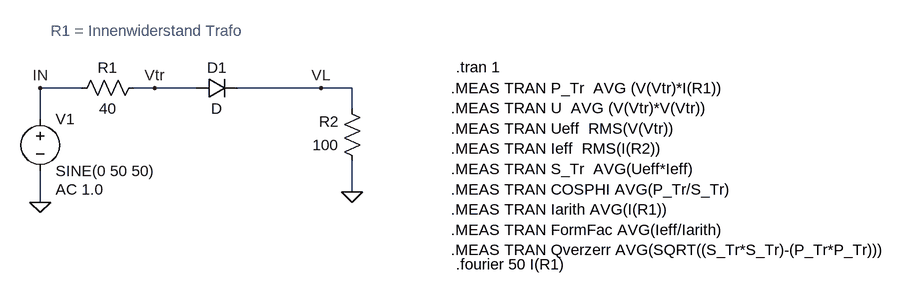
[diagram p0: schematic SingleDiodeGr_.asc]
SingleDiodeGr_.asc, the LTspice schematic file:
Version 4
SHEET 1 1124 680
WIRE -304 240 -368 240
WIRE -192 240 -224 240
WIRE -128 240 -192 240
WIRE 64 240 -64 240
WIRE 112 240 64 240
WIRE 112 272 112 240
WIRE -368 288 -368 240
WIRE 112 400 112 352
WIRE -368 416 -368 368
FLAG -368 416 0
FLAG -368 240 IN
FLAG 112 400 0
FLAG -192 240 Vtr
FLAG 64 240 VL
SYMBOL voltage -368 272 R0
WINDOW 123 24 124 Left 2
WINDOW 39 0 0 Left 2
SYMATTR Value2 AC 1.0
SYMATTR InstName V1
SYMATTR Value SINE(0 50 50)
SYMBOL res -208 224 R90
WINDOW 0 0 56 VBottom 2
WINDOW 3 32 56 VTop 2
SYMATTR InstName R1
SYMATTR Value 40
SYMBOL diode -128 256 R270
WINDOW 0 32 32 VTop 2
WINDOW 3 0 32 VBottom 2
SYMATTR InstName D1
SYMBOL res 128 368 R180
WINDOW 0 36 76 Left 2
WINDOW 3 36 40 Left 2
SYMATTR InstName R2
SYMATTR Value 100
TEXT 264 240 Left 2 !.MEAS TRAN P_Tr  AVG (V(Vtr)*I(R1))\n.MEAS TRAN U  AVG (V(Vtr)*V(Vtr))\n.MEAS TRAN Ueff  RMS(V(Vtr))\n.MEAS TRAN Ieff  RMS(I(R2))\n.MEAS TRAN S_Tr  AVG(Ueff*Ieff)\n.MEAS TRAN COSPHI AVG(P_Tr/S_Tr)\n.MEAS TRAN Iarith AVG(I(R1))\n.MEAS TRAN FormFac AVG(Ieff/Iarith)\n.MEAS TRAN Qverzerr AVG(SQRT((S_Tr*S_Tr)-(P_Tr*P_Tr)))
TEXT 272 208 Left 2 !.tran 1
TEXT 272 512 Left 2 !.fourier 50 I(R1)
TEXT -352 152 Left 2 ;R1 = Innenwiderstand Trafo

The netlist it stands for:
* SingleDiodeGr_.asc
V1 IN 0 SINE(0 50 50) AC 1.0
R1 Vtr IN 40
D1 Vtr VL D
R2 0 VL 100
.model D D
.lib standard.dio
.MEAS TRAN P_Tr  AVG (V(Vtr)*I(R1))
.MEAS TRAN U  AVG (V(Vtr)*V(Vtr))
.MEAS TRAN Ueff  RMS(V(Vtr))
.MEAS TRAN Ieff  RMS(I(R2))
.MEAS TRAN S_Tr  AVG(Ueff*Ieff)
.MEAS TRAN COSPHI AVG(P_Tr/S_Tr)
.MEAS TRAN Iarith AVG(I(R1))
.MEAS TRAN FormFac AVG(Ieff/Iarith)
.MEAS TRAN Qverzerr AVG(SQRT((S_Tr*S_Tr)-(P_Tr*P_Tr)))
.tran 1
.fourier 50 I(R1)
* R1 = Innenwiderstand Trafo
.backanno
.end

* Results of the author's LTspice run, read from the files saved beside the schematic
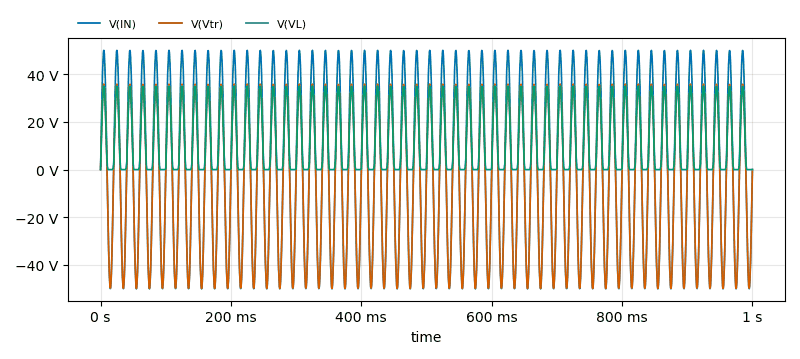
[diagram p1: Transient Analysis of SingleDiodeGr_.asc, plotted from the saved traces]
* Transient Analysis, 1 run:
*   V(IN): min -50 V, max 50 V, average 3.958 mV, rms 35.43 V, last 0 V
*   V(Vtr): min -49.87 V, max 35.86 V, average -4.433 V, rms 30.47 V, last 0 V
*   V(VL): min 0 V, max 35.05 V, average 11.14 V, rms 17.31 V, last 0 V
* From the log:
*   N-Period=1
*   Fourier components of I(r1)
*   DC component:-0.111395
*   Harmonic  Frequency   Fourier   Normalized   Phase    Normalized
*    Number     [Hz]     Component   Component  [degree]  Phase [deg]
*       1     5.000e+01  1.720e-01  1.000e+00    179.35°      0.00°
*       2     1.000e+02  6.999e-02  4.068e-01     90.42°    -88.93°
*       3     1.500e+02  2.866e-03  1.666e-02     48.95°   -130.39°
*       4     2.000e+02  9.007e-03  5.235e-02     91.76°    -87.58°
*       5     2.500e+02  1.852e-03  1.076e-02    130.32°    -49.03°
*       6     3.000e+02  3.410e-03  1.982e-02    101.83°    -77.52°
*       7     3.500e+02  1.288e-03  7.489e-03    105.24°    -74.11°
*       8     4.000e+02  1.028e-03  5.978e-03    113.57°    -65.78°
*       9     4.500e+02  6.797e-04  3.951e-03    135.36°    -43.98°
*   Total Harmonic Distortion: 41.124176%(41.175645%)
*   p_tr: AVG(v(vtr)*i(r1))=-3.0296 FROM 0 TO 1
*   u: AVG(v(vtr)*v(vtr))=915.171 FROM 0 TO 1
*   ueff: RMS(v(vtr))=30.2518 FROM 0 TO 1
*   ieff: RMS(i(r2))=0.172181 FROM 0 TO 1
*   s_tr: AVG(ueff*ieff)=5.20879 FROM 0 TO 1
*   cosphi: AVG(p_tr/s_tr)=-0.581633 FROM 0 TO 1
*   iarith: AVG(i(r1))=-0.111401 FROM 0 TO 1
*   formfac: AVG(ieff/iarith)=-1.54559 FROM 0 TO 1
*   qverzerr: AVG(sqrt((s_tr*s_tr)-(p_tr*p_tr)))=4.23709 FROM 0 TO 1